# EAGLE design STM32-G0-Dip-Module (EAGLE 9.6.2)

## Sheet 1 of 2
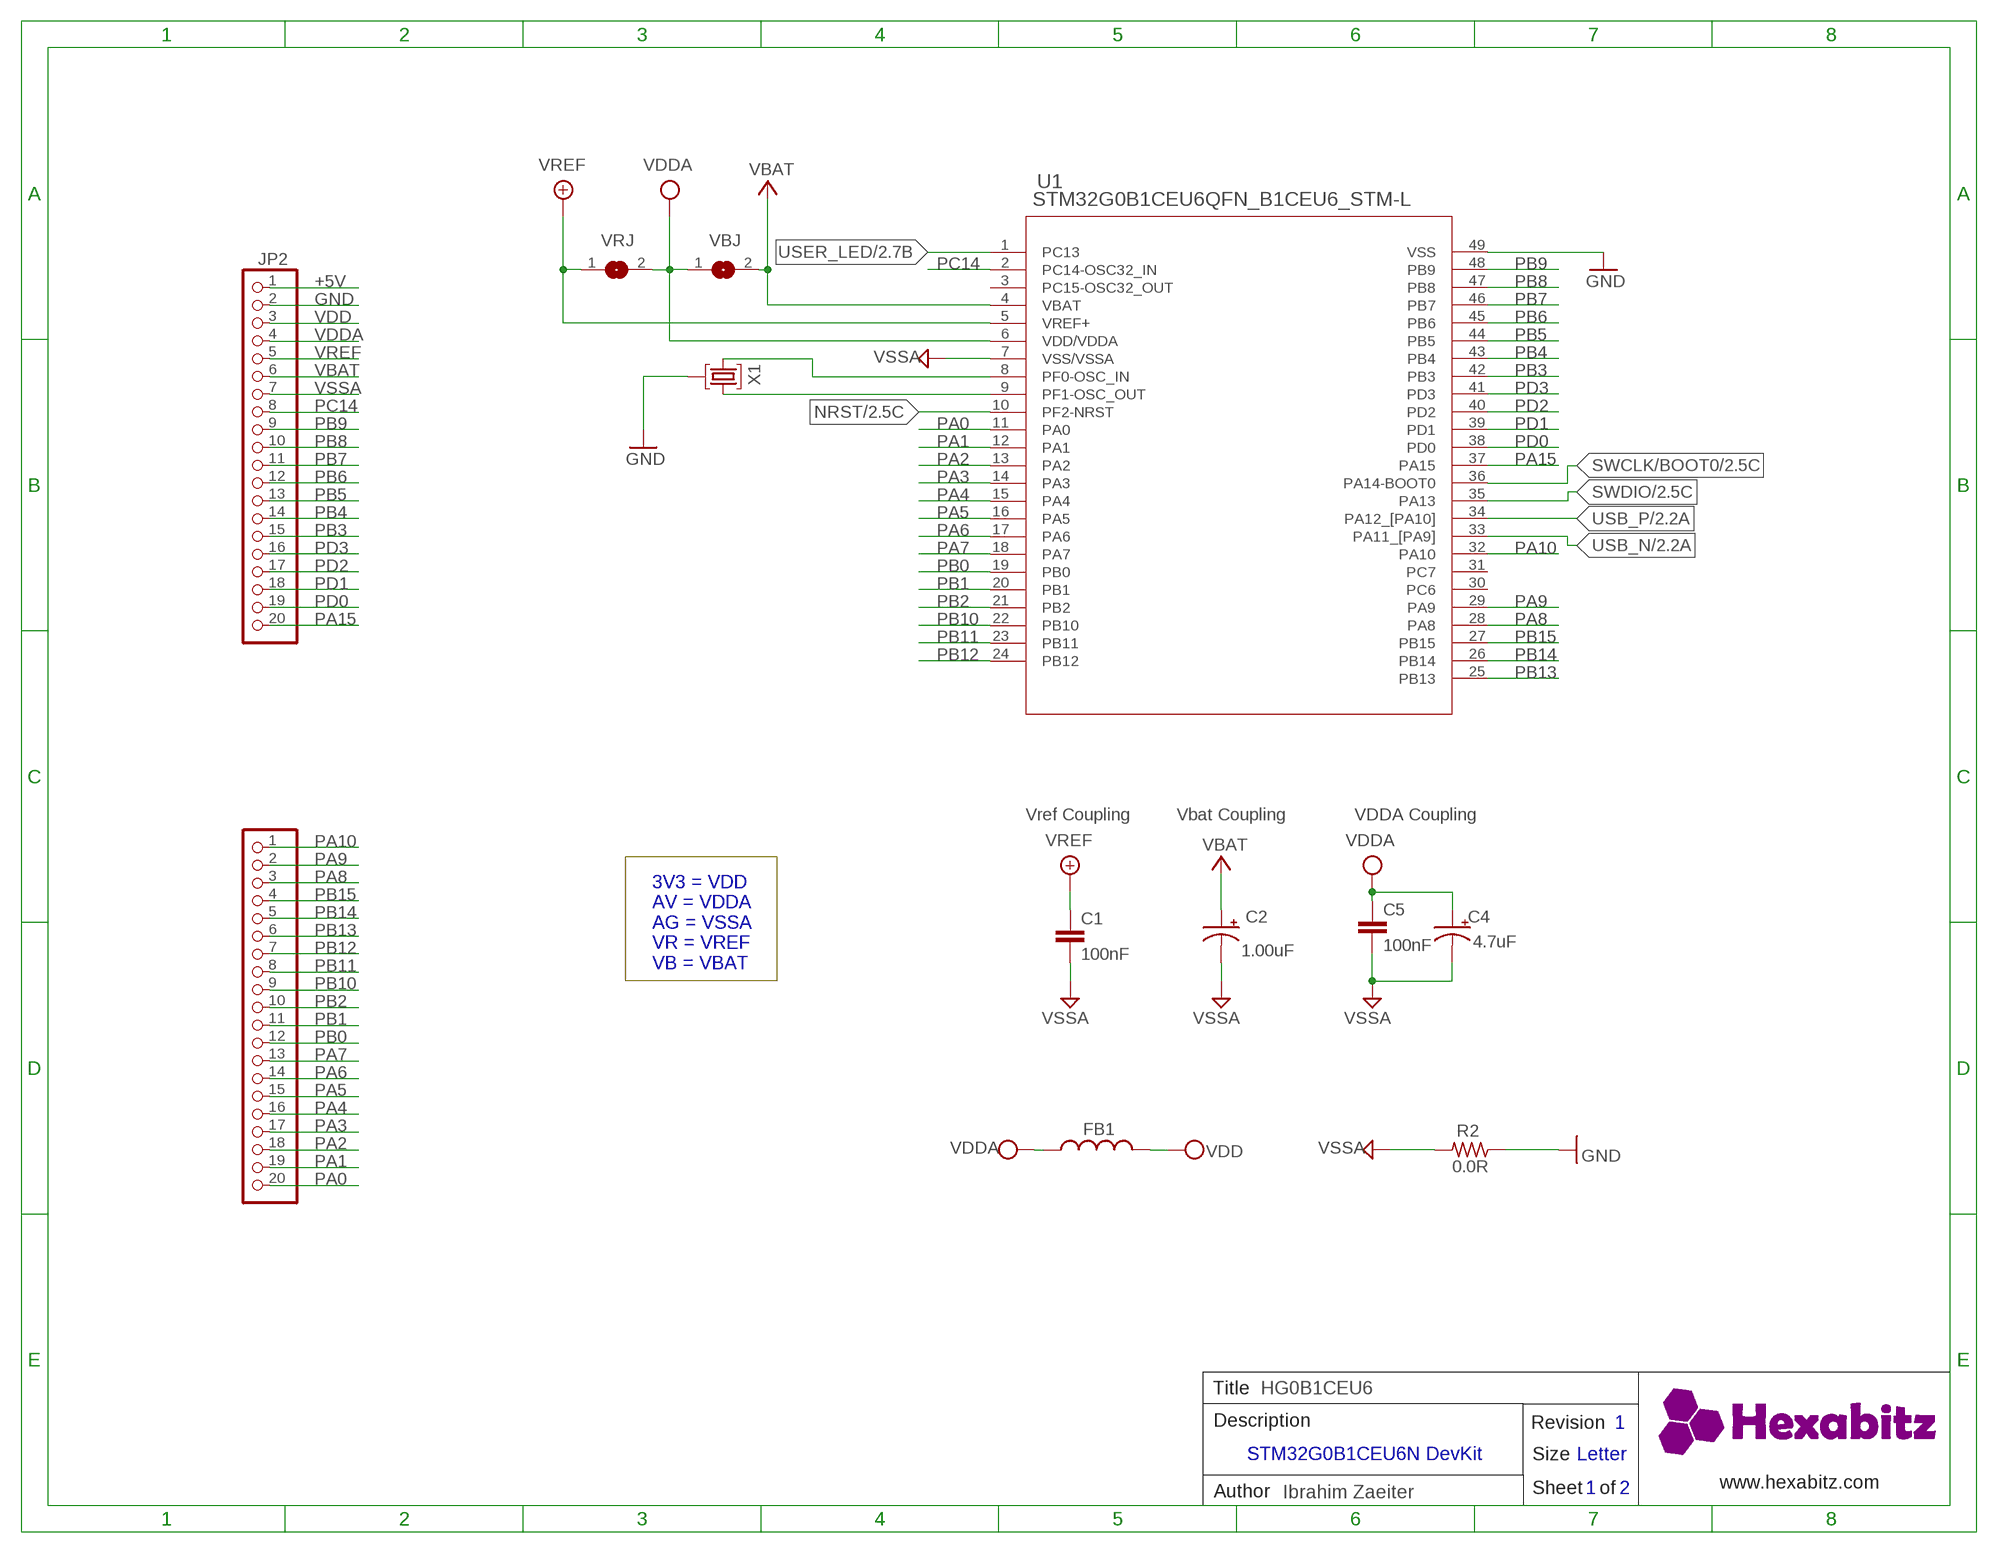
[diagram p0: schematic, sheet 1]

### Parts
C1  100nF  C-0603  [C-0603]
C2  1.00uF  C-0805-POL  [C-0805-POL]
C4  4.7uF  C-0805-POL  [C-0805-POL]
C5  100nF  C-0603  [C-0603]
FB1  FB-TDK_MMZ1608Y300B  [FB-TDK_MMZ1608Y300B]
JP1  PINHD-1X20  [1X20]
JP2  PINHD-1X20  [1X20]
R2  0.0R  R-0603  [R-0603]
U1  STM32G0B1CEU6QFN_B1CEU6_STM-L  [QFN_B1CEU6_STM-L]
VBJ  SJ  [SJ]
VRJ  SJ  [SJ]
X1  XTALL_CSTCE8M00G52  [XTALL_CSTCE8M00G52]

### Nets
+5V: JP2.1 ; also sheet 2
CRYSTAL_N: U1.8(PF0-OSC_IN) X1.P$1
CRYSTAL_P: U1.9(PF1-OSC_OUT) X1.P$3
GND: JP2.2 R2.1 U1.49(VSS) X1.P$2 ; also sheet 2
NRST: U1.10(PF2-NRST) ; also sheet 2
PA0: JP1.20 U1.11(PA0)
PA1: JP1.19 U1.12(PA1)
PA2: JP1.18 U1.13(PA2)
PA3: JP1.17 U1.14(PA3)
PA4: JP1.16 U1.15(PA4)
PA5: JP1.15 U1.16(PA5)
PA6: JP1.14 U1.17(PA6)
PA7: JP1.13 U1.18(PA7)
PA8: JP1.3 U1.28(PA8)
PA9: JP1.2 U1.29(PA9)
PA10: JP1.1 U1.32(PA10)
PA15: JP2.20 U1.37(PA15)
PB0: JP1.12 U1.19(PB0)
PB1: JP1.11 U1.20(PB1)
PB2: JP1.10 U1.21(PB2)
PB3: JP2.15 U1.42(PB3)
PB4: JP2.14 U1.43(PB4)
PB5: JP2.13 U1.44(PB5)
PB6: JP2.12 U1.45(PB6)
PB7: JP2.11 U1.46(PB7)
PB8: JP2.10 U1.47(PB8)
PB9: JP2.9 U1.48(PB9)
PB10: JP1.9 U1.22(PB10)
PB11: JP1.8 U1.23(PB11)
PB12: JP1.7 U1.24(PB12)
PB13: JP1.6 U1.25(PB13)
PB14: JP1.5 U1.26(PB14)
PB15: JP1.4 U1.27(PB15)
PC14: JP2.8 U1.2(PC14-OSC32_IN)
PD0: JP2.19 U1.38(PD0)
PD1: JP2.18 U1.39(PD1)
PD2: JP2.17 U1.40(PD2)
PD3: JP2.16 U1.41(PD3)
SWCLK/BOOT0: U1.36(PA14-BOOT0) ; also sheet 2
SWDIO: U1.35(PA13) ; also sheet 2
USB_N [diff pairs]: U1.33(PA11_[PA9]) ; also sheet 2
USB_P [diff pairs]: U1.34(PA12_[PA10]) ; also sheet 2
USER_LED: U1.1(PC13) ; also sheet 2
VBAT: C2.1(+) JP2.6 U1.4(VBAT) VBJ.2
VDD: FB1.2 JP2.3 ; also sheet 2
VDDA: C4.1(+) C5.1 FB1.1 JP2.4 U1.6(VDD/VDDA) VBJ.1 VRJ.2
VREF: C1.1 JP2.5 U1.5(VREF+) VRJ.1
VSSA: C1.2 C2.2(-) C4.2(-) C5.2 JP2.7 R2.2 U1.7(VSS/VSSA)
Unconnected: U1.3(PC15-OSC32_OUT) U1.30(PC6) U1.31(PC7)

### Notes on the sheet
- C:/Users/Admin/Desktop/logodraft.bmp
- Vref Coupling | Vbat Coupling | VDDA Coupling
- 3V3 = VDD
  AV = VDDA
  AG = VSSA
  VR = VREF
  VB = VBAT
- Title | HG0B1CEU6
- Description | Revision | 1
- STM32G0B1CEU6N DevKit
- Size | Letter
- www.hexabitz.com
- Author | Ibrahim Zaeiter | Sheet   of | 1 | 2

## Sheet 2 of 2
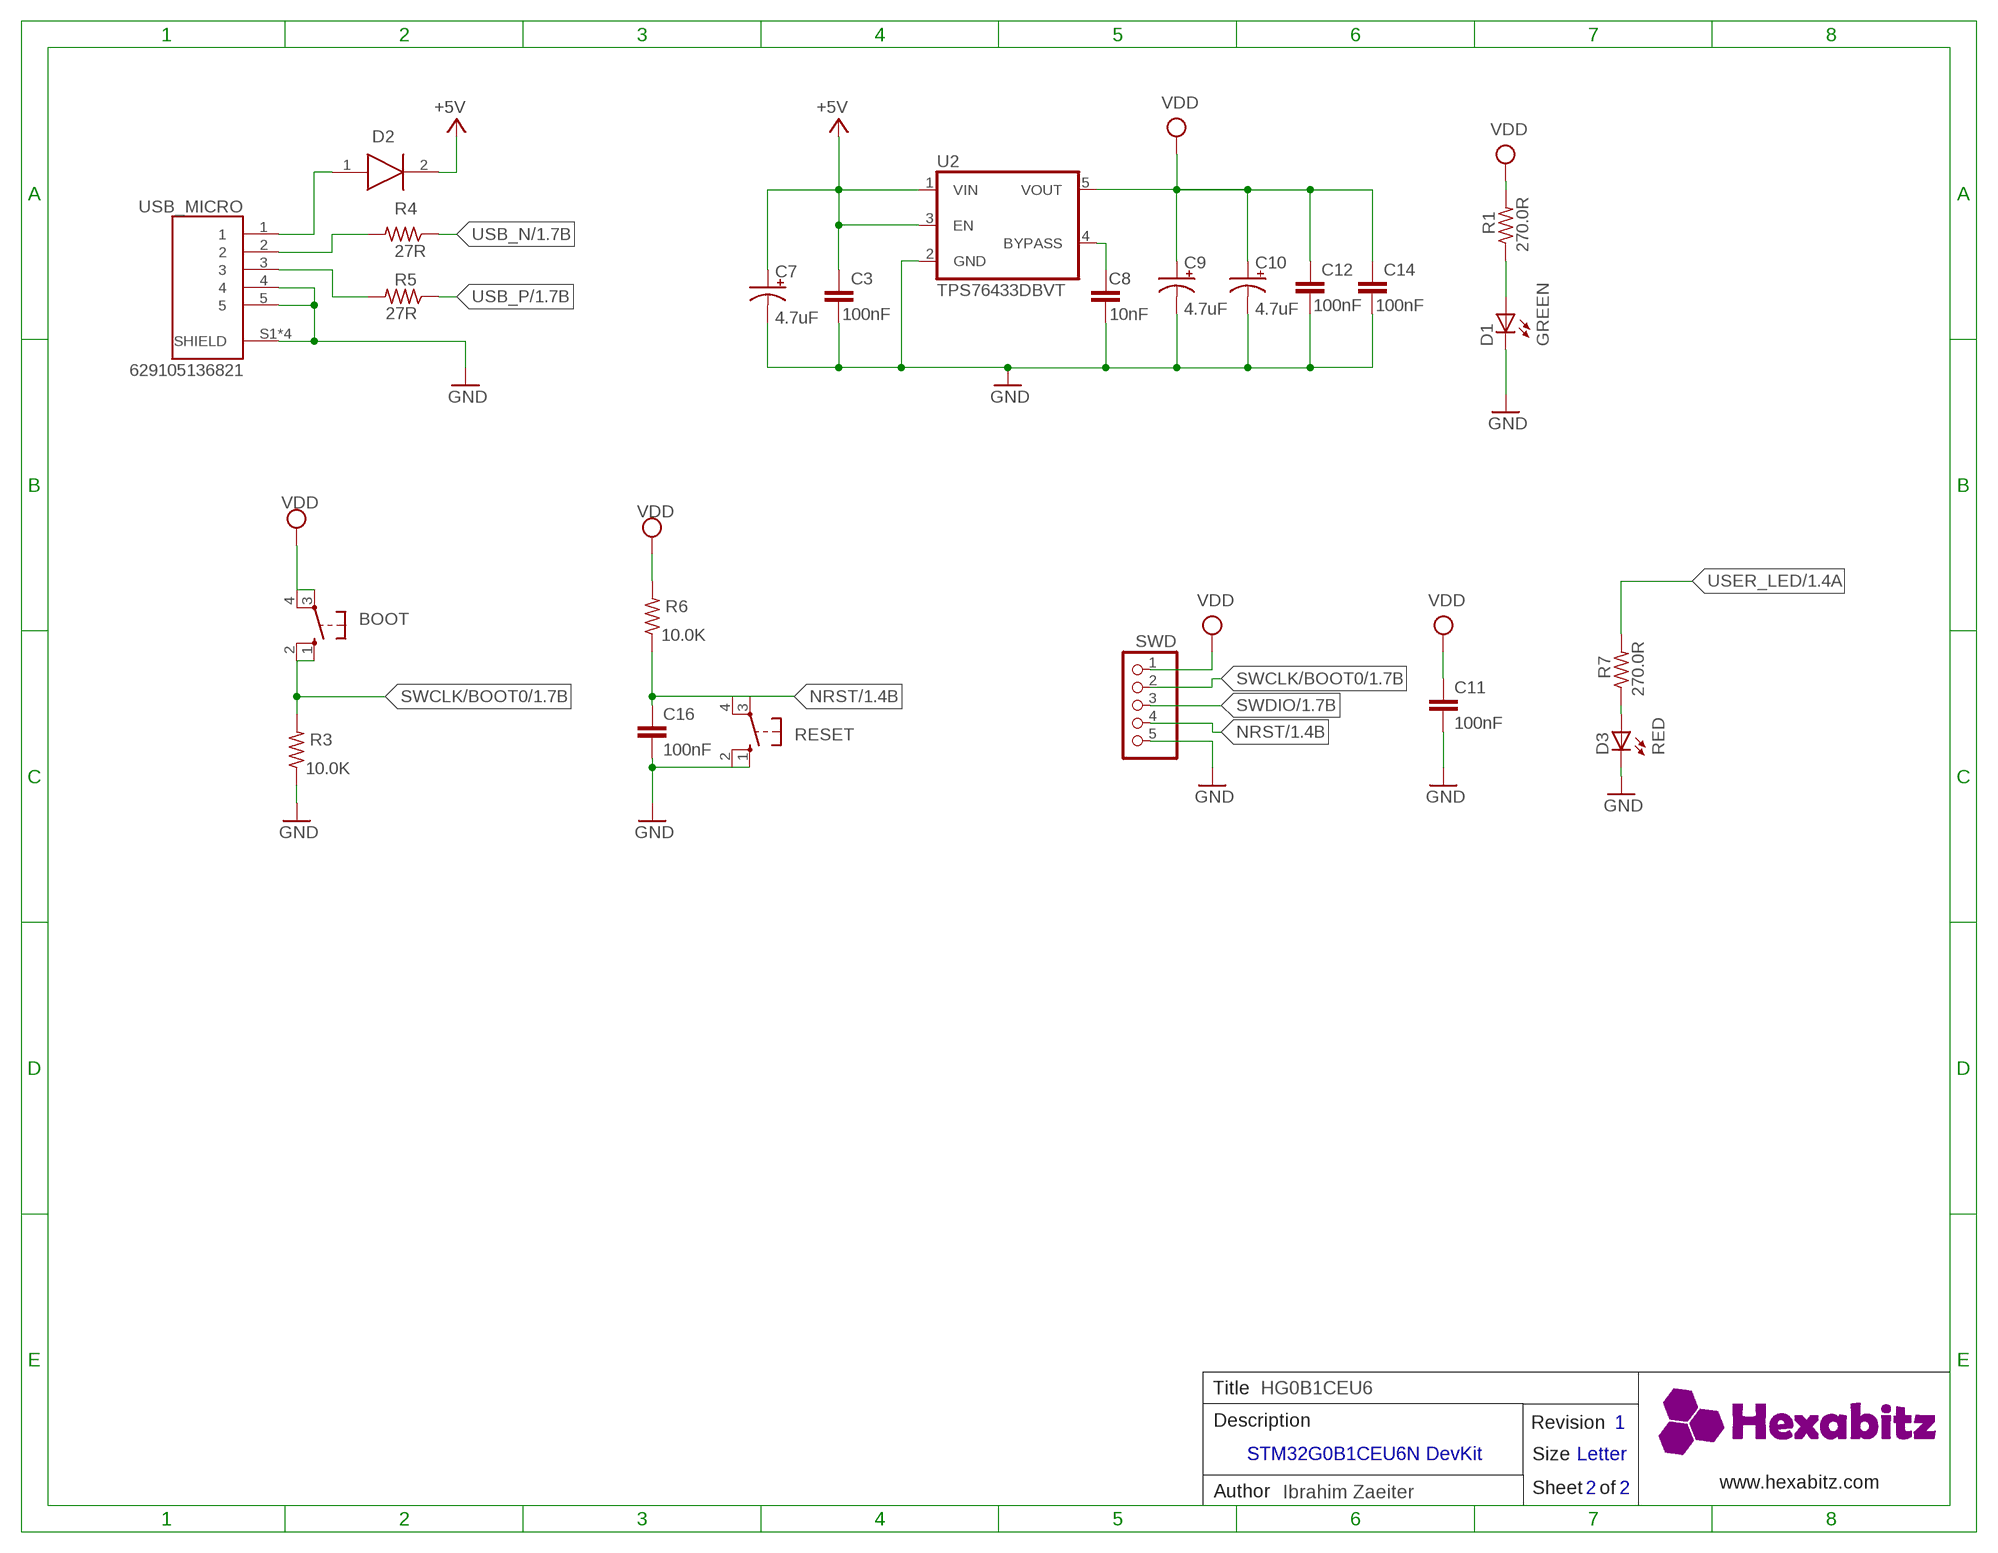
[diagram p1: schematic, sheet 2]

### Parts
BOOT  10-XX  [B3F-10XX]
C3  100nF  C-0603  [C-0603]
C7  4.7uF  C-0805-POL  [C-0805-POL]
C8  10nF  C-0603  [C-0603]
C9  4.7uF  C-0805-POL  [C-0805-POL]
C10  4.7uF  C-0805-POL  [C-0805-POL]
C11  100nF  C-0603  [C-0603]
C12  100nF  C-0603  [C-0603]
C14  100nF  C-0603  [C-0603]
C16  100nF  C-0603  [C-0603]
D1  GREEN  VLMS1300-GS08  [VLMS1300-GS08]
D2  FSM17PL-TP  [FSM17PL-TP]
D3  RED  VLMS1300-GS08  [VLMS1300-GS08]
R1  270.0R  R-0603  [R-0603]
R3  10.0K  R-0603  [R-0603]
R4  27R  R-0603  [R-0603]
R5  27R  R-0603  [R-0603]
R6  10.0K  R-0603  [R-0603]
R7  270.0R  R-0603  [R-0603]
RESET  10-XX  [B3F-10XX]
SWD  PINHD-1X5/90  [1X05/90]
U2  TPS76433DBVT  [SOT25]
USB_MICRO  629105136821  [WE_629105136821]

### Nets
+5V: C3.1 C7.1(+) D2.2(K) U2.1(VIN) U2.3(EN) ; also sheet 1
D_N [diff pairs]: R4.2 USB_MICRO.2
D_P [diff pairs]: R5.2 USB_MICRO.3
GND: C3.2 C7.2(-) C8.2 C9.2(-) C10.2(-) C11.2 C12.2 C14.2 C16.2 D1.C D3.C R3.1 RESET.1(S) RESET.2(S1) SWD.5 U2.2(GND) USB_MICRO.4 USB_MICRO.5 USB_MICRO.S1(SHIELD) USB_MICRO.S2(SHIELD) USB_MICRO.S3(SHIELD) USB_MICRO.S4(SHIELD) ; also sheet 1
N$1: D2.1(A) USB_MICRO.1
N$2: D3.A R7.1
N$4: D1.A R1.1
N$9: C8.1 U2.4(BYPASS)
NRST: C16.1 R6.1 RESET.3(P) RESET.4(P1) SWD.4 ; also sheet 1
SWCLK/BOOT0: BOOT.1(S) BOOT.2(S1) R3.2 SWD.2 ; also sheet 1
SWDIO: SWD.3 ; also sheet 1
USB_N [diff pairs]: R4.1 ; also sheet 1
USB_P [diff pairs]: R5.1 ; also sheet 1
USER_LED: R7.2 ; also sheet 1
VDD: BOOT.3(P) BOOT.4(P1) C9.1(+) C10.1(+) C11.1 C12.1 C14.1 R1.2 R6.2 SWD.1 U2.5(VOUT) ; also sheet 1

### Notes on the sheet
- Title | HG0B1CEU6
- Description | Revision | 1
- STM32G0B1CEU6N DevKit
- Size | Letter
- www.hexabitz.com
- Author | Ibrahim Zaeiter | Sheet   of | 2 | 2

## Library data of the parts
BOOT RESET = switch-omron:10-XX: OMRON SWITCH; MPN: B3F-1000; OC_FARNELL: 176432; OC_NEWARK: 36M3542
C1 C11 C16 = HEXABITZ_RCLS:C-0603: CAP CER 10% X7R 0603; CAPACITANCE: 100nF; MFN: KEMET; MPN: C0603C104K8RACTU; OCTOPART_URL: https://octopart.com/c0603c104k8ractu-kemet-145075?r=sp&s=9bS9ASSwSEqMCE9KBEQZ0g; TOLERANCE: 10%; VOLTAGE_RATING: 10V
C2 = HEXABITZ_RCLS:C-0805-POL: Cap Tant Solid SMD 2012; CAPACITANCE: 1.00uF; MFN: Yageo; MPN: CC0805KKX7R7BB105; OCTOPART_URL: https://octopart.com/cc0805kkx7r7bb105-yageo-8376555?r=sp&s=YKl1wwtkROau_X5nniH2ig; TOLERANCE: 10%; VOLTAGE_RATING: 16V
C3 C5 C8 C12 C14 = HEXABITZ_RCLS:C-0603: CAP CER 10% X7R 0603; CAPACITANCE: 100nF; MFN: KEMET; MPN: C0603C104K8RACTU; OCTOPART_URL: https://octopart.com/c0603c104k8ractu-kemet-145075?r=sp&s=9bS9ASSwSEqMCE9KBEQZ0g; TOLERANCE: 10%; VOLTAGE_RATING: 10
C4 C7 C9 C10 = HEXABITZ_RCLS:C-0805-POL: Cap Tant Solid SMD 2012; CAPACITANCE: 4.7uF; MFN: Murata; MPN: GRM21BC81E475KA12L; OCTOPART_URL: https://octopart.com/grm21bc81e475ka12l-murata-10331911?r=sp&s=RY3qZSD8T6mG6TC9CHI5qQ; TOLERANCE: 10%; VOLTAGE_RATING: 25V
D1 = HEXABITZ_USER_INTERFACE_PARTS:VLMS1300-GS08: Red 0603 130° Clear 54 mcd 2 V Surface Mount ChipLED ; Octopart Url : http://octopart.com/vlms1300-gs08-vishay-21709201; MFN: Vishay; MPN: VLMS1300-GS08; OCTOPART_URL: https://octopart.com/vlms1300-gs08-vishay-21709201?r=sp&s=_gcP4_q8T1SC6PJQPTQ9yA; VALUE: RED
D2 = HEXABITZ_RCLS:FSM17PL-TP: 1.0 A Surface Mount Schottky Barrier Rectifier, 40 V, -65 to 125 degC, 2-Pin SOD-123 Package, RoHS, Tape and Reel
D3 = HEXABITZ_USER_INTERFACE_PARTS:VLMS1300-GS08: Red 0603 130° Clear 54 mcd 2 V Surface Mount ChipLED ; Octopart Url : http://octopart.com/vlms1300-gs08-vishay-21709201; MFN: Vishay; MPN: VLMS1300-GS08; OCTOPART_URL: https://octopart.com/vlms1300-gs08-vishay-21709201?r=sp&s=_gcP4_q8T1SC6PJQPTQ9yA
FB1 = HEXABITZ_RCLS:FB-TDK_MMZ1608Y300B: Ferrite Beads Multi-Layer 30Ohm 25% 100MHz 1.5A 50mOhm DCR 0603; MFN: TDK; MPN: MMZ1608Y300B; OCTOPART_URL: https://octopart.com/mmz1608y300b-tdk-368280?r=sp&s=cd9_2ZEqQ9q9UNBuQgHAiA
JP1 JP2 = pinhead:PINHD-1X20: PIN HEADER
R1 R7 = HEXABITZ_RCLS:R-0603: Thick Film Resistors - SMD 0603; MFN: Yageo; MPN: RC0603FR-07270RL; OCTOPART_URL: https://octopart.com/search?q=RC0603FR-07270RL&start=0; RESISTANCE: 270.0 Ohm; TOLERANCE: 1%
R2 = HEXABITZ_RCLS:R-0603: Thick Film Resistors - SMD 0603; MFN: Yageo; MPN: RC0603JR-070RL; OCTOPART_URL: https://octopart.com/rc0603jr-070rl-yageo-1241539?r=sp&s=X2NteqRjRNWrnx42Y0aliA; RESISTANCE: 0.0 Ohm
R3-R6 = HEXABITZ_RCLS:R-0603: Thick Film Resistors - SMD 0603; MFN: Yageo; MPN: RC0603JR-0710KL; OCTOPART_URL: https://octopart.com/search?q=RC0603JR-0710KL&start=0; RESISTANCE: 10.0K Ohm; TOLERANCE: 5%
SWD = pinhead:PINHD-1X5: PIN HEADER
U1 = HEXABITZ_ICs:STM32G0B1CEU6; COPYRIGHT: Copyright (C) 2021 Ultra Librarian. All rights reserved.; MANUFACTURER_PART_NUMBER: STM32G0B1CEU6; MFR_NAME: STMicroelectronics
U2 = HEXABITZ_ICs:TPS764: 150mA Low Noise LDO Voltage Regulator with Enable; MFN: Texas Instruments; MPN: TPS76433DBVT; OCTOPART_URL: https://octopart.com/tps76433dbvt-texas+instruments-69873?r=sp&s=0aHKKhMLSUCTmmqJkhwwIQ
USB_MICRO = 629105136821:629105136821: WR-COM SMT Horizontal 5 Contacts Micro USB Type B,5 pins Check availability <https://pricing.snapeda.com/parts/629105136821/W%C3%BCrth%20Elektronik/view-part?ref=eda>; AVAILABILITY: In Stock; DESCRIPTION: USB - micro B USB 2.0 Receptacle Connector 5 Position Surface Mount, Right Angle; MF: Würth Elektronik; MP: 629105136821; PACKAGE: None; PRICE: None; PURCHASE-URL: https://pricing.snapeda.com/search/part/629105136821/?ref=eda
VBJ VRJ = jumper:SJ: SMD solder JUMPER
X1 = HEXABITZ_OTHER_PARTS:XTALL_CSTCE8M00G52: MURATA CSTCE8M00G52-R0 RESONATOR, SMD, 8MHZ ; Octopart Url : https://octopart.com/cstce8m00g52-r0-murata-7145559; MFN: Murata; MPN: CSTCE8M00G52Z-R0; OCTOPART_URL: https://octopart.com/cstce8m00g52z-r0-murata-17755941?r=sp&s=JDnNJnrHQhyS8Zk4ofFWXw

## Net classes
1 diff pairs: width 0.203 mm, clearance 0.178 mm

## Board
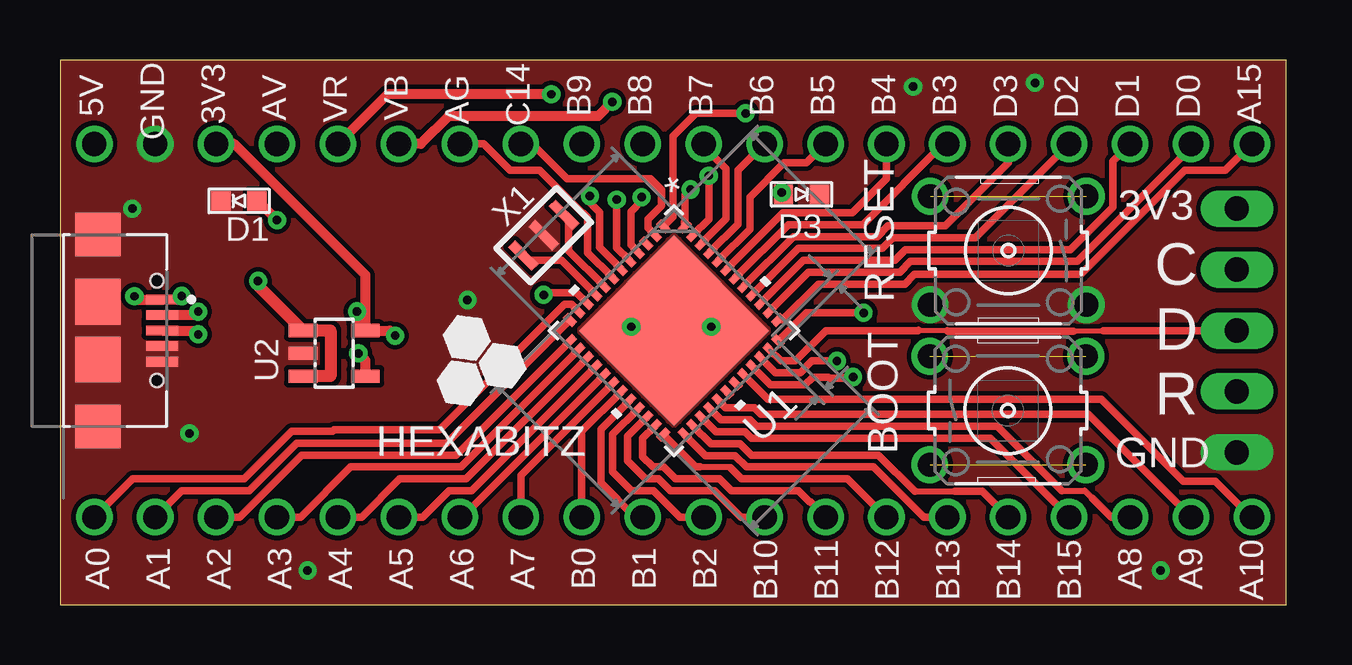
[diagram p2: board, top side]
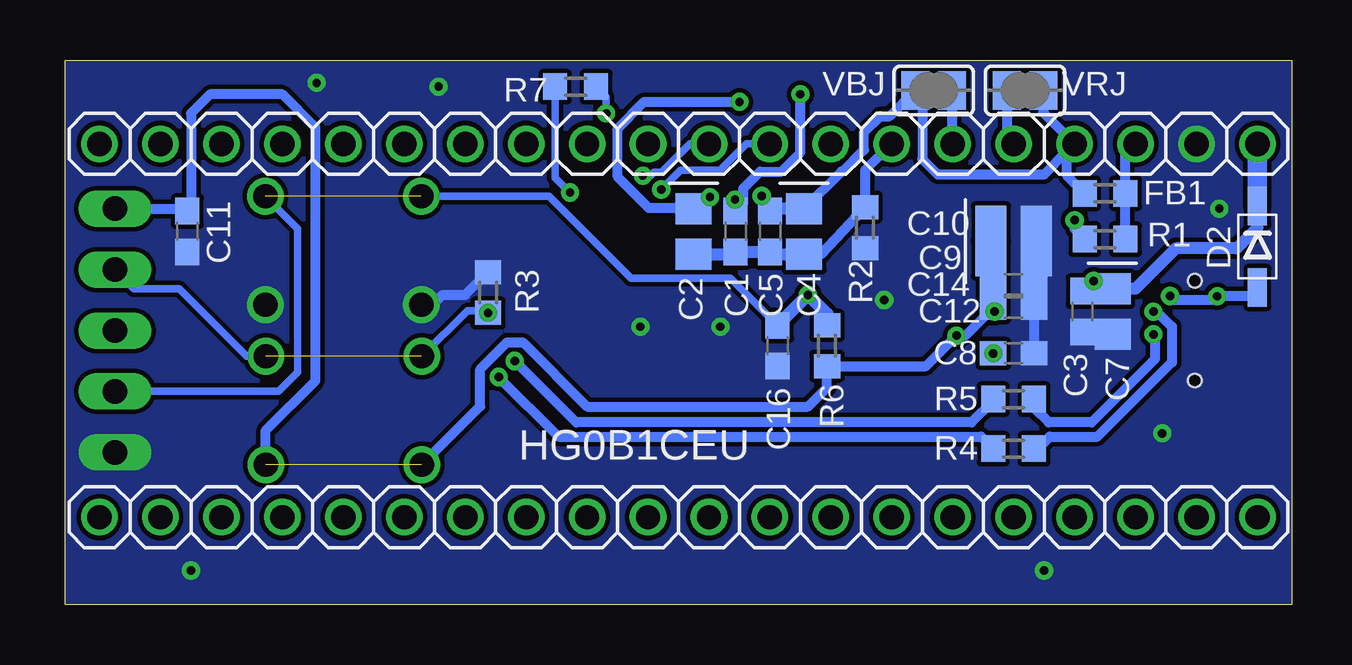
[diagram p3: board, bottom side, seen from below]

Size 51.12 x 22.7 mm. Coordinates in mm from the lower left corner, seen from the top.
Outline: 0,22.7 0,0 51.12,0 51.12,22.7 0,22.7
Copper layers (1*16): Top 0.035mm / dielectric 1.5mm / Bottom 0.035mm
Design rules "default *": minimum track width 6mil, minimum drill 0.35mm, track to track 7.5mil, track to pad 7.5mil, pad to pad 7.5mil, via to via 7.5mil, smd to smd 0mil, copper to edge 1mil, drill to drill 6mil, minimum pad ring 10mil, minimum via ring 8mil, stop-mask expansion 4mil, vias tented up to drill 25mil, thermal gap 10mil

### Footprints (pad centres in the part's own frame; a part is rotated, then mirrored left to right if it is on the bottom)
B3F-10XX = drill 1.016: 1 -3.251,2.261; 2 3.251,2.261; 3 -3.251,-2.261; 4 3.251,-2.261
C-0603 = smd 1.1 x 1: 1 -0.85,0; 2 0.85,0
C-0805-POL = smd 1.3 x 1.5: 1 -0.95,0; 2 0.95,0
VLMS1300-GS08 = smd 0.8 x 0.8: A 0,0.75; C 0,-0.75
FSM17PL-TP = smd 1.6 x 0.8: 1 -1.7,0; 2 1.7,0
FB-TDK_MMZ1608Y300B = smd 1 x 1.1: 1 -0.85,0; 2 0.85,0
1X20 = drill 1.016: 1 -24.13,0; 2 -21.59,0; 3 -19.05,0; 4 -16.51,0; 5 -13.97,0; 6 -11.43,0; 7 -8.89,0; 8 -6.35,0; 9 -3.81,0; 10 -1.27,0; 11 1.27,0; 12 3.81,0; 13 6.35,0; 14 8.89,0; 15 11.43,0; 16 13.97,0; 17 16.51,0; 18 19.05,0; 19 21.59,0; 20 24.13,0
R-0603 = smd 1 x 1.1: 1 -0.85,0; 2 0.85,0
1X05/90 = drill 1.016 long: 1 -5.08,-3.81; 2 -2.54,-3.81; 3 0,-3.81; 4 2.54,-3.81; 5 5.08,-3.81
QFN_B1CEU6_STM-L = smd 0.55 x 0.3: 1 -3.38,2.751; 2 -3.38,2.251; 3 -3.38,1.75; 4 -3.38,1.25; 5 -3.38,0.75; 6 -3.38,0.25; 7 -3.38,-0.25; 8 -3.38,-0.75; 9 -3.38,-1.25; 10 -3.38,-1.75; 11 -3.38,-2.251; 12 -3.38,-2.751; 25 3.38,-2.751; 26 3.38,-2.251; 27 3.38,-1.75; 28 3.38,-1.25; 29 3.38,-0.75; 30 3.38,-0.25; 31 3.38,0.25; 32 3.38,0.75; 33 3.38,1.25; 34 3.38,1.75; 35 3.38,2.251; 36 3.38,2.751 | smd 0.3 x 0.55: 13 -2.751,-3.38; 14 -2.251,-3.38; 15 -1.75,-3.38; 16 -1.25,-3.38; 17 -0.75,-3.38; 18 -0.25,-3.38; 19 0.25,-3.38; 20 0.75,-3.38; 21 1.25,-3.38; 22 1.75,-3.38; 23 2.251,-3.38; 24 2.751,-3.38; 37 2.751,3.38; 38 2.251,3.38; 39 1.75,3.38; 40 1.25,3.38; 41 0.75,3.38; 42 0.25,3.38; 43 -0.25,3.38; 44 -0.75,3.38; 45 -1.25,3.38; 46 -1.75,3.38; 47 -2.251,3.38; 48 -2.751,3.38 | smd 5.6 x 5.6: 49 0,0
SOT25 = smd 0.55 x 1.2: 1 -0.95,-1.3; 2 0,-1.3; 3 0.95,-1.3; 4 0.95,1.3; 5 -0.95,1.3
WE_629105136821 = smd 0.4 x 1.35: 1 -1.3,2.675; 2 -0.65,2.675; 3 0,2.675; 4 0.65,2.675; 5 1.3,2.675 | smd 1.8 x 1.9: S1 -4,0; S4 4,0 | smd 1.9 x 1.9: S2 -1.2,0; S3 1.2,0 | hole 0.55: -2.075,2.45; 2.075,2.45
SJ = smd 1.168 x 1.6: 1 -0.762,0; 2 0.762,0
XTALL_CSTCE8M00G52 = smd 1.4 x 0.4: P$1 0,1.2; P$2 0,0; P$3 0,-1.2

### Placement (x,y rotation side)
BOOT  39.51,8.1 0 top
C1  23.18,15.56 270 bottom
C2  24.92,15.56 270 bottom
C3  8.73,12.22 270 bottom
C4  20.32,15.56 270 bottom
C5  21.75,15.56 270 bottom
C7  7.46,12.22 270 bottom
C8  11.59,10.48 0 bottom
C9  11.59,14.45 0 bottom
C10  11.59,15.88 0 bottom
C11  46.04,15.56 270 bottom
C12  11.59,12.38 0 bottom
C14  11.59,13.34 0 bottom
C16  21.43,10.79 270 bottom
D1  7.46,16.83 270 top
D2  1.43,14.92 90 bottom
D3  30.91,17.1 90 top
FB1  7.78,17.14 0 bottom
JP1  25.56,3.65 180 top
JP2  25.56,19.21 0 top
R1  7.78,15.24 0 bottom
R2  17.78,15.72 90 bottom
R3  33.5,13.02 270 bottom
R4  11.59,6.51 0 bottom
R5  11.59,8.57 0 bottom
R6  19.37,10.79 270 bottom
R7  29.84,21.59 0 bottom
RESET  39.53,14.76 180 top
SWD  52.86,11.43 270 top
U1  25.59,11.43 315 top
U2  11.43,10.48 270 top
USB_MICRO  1.59,11.43 270 top
VBJ  14.92,21.43 0 bottom
VRJ  11.11,21.43 0 bottom
X1  20.16,15.4 315 top

### Tracks (layer width: path | path; a pad name or v marks a point on that pad's centre or on a via)
+5V  (via drill 0.35)
  Top 0.508: U2.3 11.27,9.53 11.27,11.43 U2.1 8.25,13.3 v8.25,13.49
  Bottom 0.508: 1.43,17.14 1.43,15.72 2.29,14.85 4.83,14.85 6.51,13.17 C7.1 7.94,13.17 v8.25,13.49 8.31,13.49 C3.1
  Bottom 0.813: JP2.1 1.43,17.14 D2.2
CRYSTAL_N
  Top 0.305: X1.P$1 21.2,16.05 21.2,14.76 U1.8
CRYSTAL_P
  Top 0.305: X1.P$3 19.51,14.36 20.9,14.36 U1.9
D_N  (via drill 0.35)
  Top 0.406: USB_MICRO.2 5.75,12.08 5.76,12.09 v5.76,12.22
  Bottom 0.406: R4.2 10.58,6.51 10.08,7 8.09,7 4.99,10.11 4.99,11.59 5.62,12.22 v5.76,12.22
D_P  (via drill 0.35)
  Top 0.406: USB_MICRO.3 5.75,11.43 5.76,11.42 v5.76,11.27
  Bottom 0.406: R5.2 10.74,8.21 10.13,7.6 8.34,7.6 5.71,10.23 5.71,11.22 v5.76,11.27
GND  (via drill 0.35)
  Bottom 0.406: C10.2 C9.2 10.74,14.35 C14.2 C12.2 C8.2 | R3.1 34.45,12.91 35.39,12.91 35.8,12.5 RESET.2
  other vias: 23.81,11.59 27.15,11.59 16.99,12.7 5.4,7.14 3.02,16.51 10.32,1.43 45.88,1.43 40.64,21.75 35.56,21.59
  pour Bottom (no thermals): 0,22.7 51.12,22.7 51.12,0 0,0
  pour Top (no thermals): 0,22.7 51.12,22.7 51.12,0 0,0
N$1  (via drill 0.35)
  Top 0.406: v3.11,12.86 3.26,12.7 4.23,12.7 USB_MICRO.1 4.28,12.71 4.91,12.71 v5.07,12.87
  Bottom 0.406: D2.1 1.79,12.86 v3.11,12.86 3.26,12.71 4.91,12.71 v5.07,12.87
N$2  (via drill 0.35)
  Top 0.305: v30.08,17.18 D3.A
  Bottom 0.305: R7.1 30.69,17.79 v30.08,17.18
N$4  (via drill 0.35)
  Top 0.406: v9.05,16.03 8.25,16.83 D1.A
  Bottom 0.406: v9.05,16.03 9.05,15.66 R1.1
N$9  (via drill 0.35)
  Top 0.406: U2.4 12.73,10.19 C8.1
  other vias: 12.44,10.48
NRST  (via drill 0.35)  (1 unrouted)
  Top 0.305: v20.16,12.91 20.26,13.01 21.53,13.01 U1.10
  Bottom 0.305: SWD.4 42.23,8.89 41.43,9.68 41.43,15.68 RESET.3 | RESET.4 30.95,17.02 27.54,13.62 23.4,13.62 C16.1
  Bottom 0.533: C16.1 v20.16,12.91 19.37,12.12 R6.1
PA0
  Top 0.305: JP1.20 3.03,5.25 7.69,5.25 9.67,7.23 11.36,7.23 11.43,7.3 15.82,7.3 20.62,12.1 20.61,12.1 21.03,12.52 21.31,12.52 U1.11
PA1
  Top 0.305: U1.12 20.33,10.95 16.12,6.74 9.87,6.74 7.89,4.76 5.07,4.76 JP1.19
PA2
  Top 0.305: JP1.18 7.49,3.65 10.08,6.24 16.51,6.24 U1.13
PA3
  Top 0.305: U1.14 16.73,5.75 12.12,5.75 10.03,3.65 JP1.17
PA4
  Top 0.305: U1.15 16.94,5.25 14.17,5.25 12.57,3.65 JP1.16
PA5
  Top 0.305: U1.16 17.15,4.76 16.21,4.76 15.11,3.65 JP1.15
PA6
  Top 0.305: U1.17 16.75,3.65 JP1.14
PA7
  Top 0.305: U1.18 19.21,5.4 JP1.13
PA8
  Top 0.254: 41.75,4.76 42.71,4.76 43.02,4.45
  Top 0.305: U1.28 27.56,7.7 28.75,7.7 29.02,7.44 39.07,7.44 41.75,4.76 | 43.02,4.45 43.81,3.65 JP1.3
PA9
  Top 0.305: U1.29 27.74,8.22 28.94,8.22 29.23,7.93 42.87,7.93 JP1.2
PA10
  Top 0.305: JP1.1 49.66,3.65 48.16,5.15 46.82,5.15 43.4,8.57 29.51,8.57 U1.32
PA15
  Top 0.305: U1.37 30.12,11.88 31.61,13.37 35.21,13.37 35.61,13.77 42.56,13.77 46.89,18.1 48.58,18.1 JP2.20
PB0
  Top 0.305: JP1.12 21.75,7.23 U1.19
PB1
  Top 0.305: JP1.11 23.97,3.65 22.54,5.08 22.54,7.32 U1.20
PB2
  Top 0.305: JP1.10 25.85,3.65 24.75,4.76 23.82,4.76 23.04,5.54 23.04,7.11 U1.21
PB3
  Top 0.305: U1.42 30.36,15.84 33.46,15.84 36.83,19.21 JP2.15
PB4
  Top 0.305: JP2.14 34.45,17.76 33.03,16.34 30.14,16.34 U1.43
PB5
  Top 0.305: U1.44 28.76,15.66 28.76,16.99 30.18,18.41 31.11,18.41 JP2.13
PB6
  Top 0.305: U1.45 28.26,15.87 28.26,18.1 JP2.12
PB7
  Top 0.305: JP2.11 26.83,19.11 27.77,18.18 27.77,16.08 U1.46
PB8  (via drill 0.35)
  Top 0.305: v27.04,17.88 27.04,16.07 U1.47
  Bottom 0.305: JP2.10 25.08,19.21 26.26,18.02 26.58,18.02 26.73,17.88 v27.04,17.88
PB9  (via drill 0.35)
  Top 0.305: v26.28,17.3 26.05,17.08 26.05,15.97 26.04,15.96 U1.48
  Bottom 0.305: JP2.9 22.73,19.21 23.83,18.1 25.48,18.1 v26.28,17.3
PB10
  Top 0.305: JP1.9 28.39,3.65 27.29,4.76 25.45,4.76 24.95,5.25 24.41,5.25 23.65,6 23.65,7.02 U1.22
PB11
  Top 0.305: JP1.8 31.27,4.29 31.25,4.29 30.78,4.76 27.99,4.76 27.49,5.25 25.65,5.25 25.16,5.75 24.72,5.75 24.29,6.18 24.29,6.94 U1.23
PB12
  Top 0.254: 26.67,5.75 27.91,5.75 27.94,5.71
  Top 0.305: U1.24 26.49,5.75 26.67,5.75 | 27.94,5.71 28.4,5.25 32.82,5.25 34.42,3.65 JP1.7
PB13
  Top 0.305: JP1.6 36.01,3.65 33.92,5.75 28.61,5.75 28.14,6.22 26.91,6.22 U1.25
PB14
  Top 0.254: 35.63,4.73 37.31,4.73
  Top 0.305: 35.63,4.73 34.12,6.24 28.81,6.24 28.34,6.71 27.13,6.71 U1.26 | 37.31,4.73 38.45,4.73 JP1.5
PB15
  Top 0.305: U1.27 27.35,7.21 28.55,7.21 28.82,6.94 38.78,6.94 JP1.4
PC14
  Top 0.305: U1.2 24.5,15.71 24.5,16.07 25.06,16.62 25.06,17.3 24.61,17.75 21.14,17.75 19.68,19.21 JP2.8
PD0
  Top 0.305: JP2.19 47.15,19.06 42.4,14.31 35.45,14.31 35.01,13.86 31.2,13.86 U1.38
PD1
  Top 0.305: U1.39 30.99,14.36 34.8,14.36 35.25,14.8 42.12,14.8 43.88,16.57 43.88,18.48 JP2.18
PD2
  Top 0.305: U1.40 30.79,14.85 34.28,14.85 34.73,15.3 38.16,15.3 JP2.17
PD3
  Top 0.305: JP2.16 39.53,18.41 36.91,15.79 34.52,15.79 34.07,15.35 30.57,15.35 U1.41
SWCLK/BOOT0  (via drill 0.35)  (1 unrouted)
  Top 0.305: U1.36 31.11,12.17 R3.2
  Bottom 0.305: R3.2 33.59,12.26 34.35,12.26 BOOT.1 | BOOT.2 43.55,10.36 46.37,13.18 48.26,13.18 SWD.2
  other vias: 33.5,12.17
SWDIO
  Top 0.203: 35.78,11.44 36.98,11.44 36.99,11.43 | 42.25,11.41 42.32,11.41 43.48,11.41 43.5,11.43
  Top 0.305: 35.78,11.44 35.77,11.43 31.92,11.43 30.65,10.16 30.04,10.16 U1.35 | 36.99,11.43 37.01,11.41 42.25,11.41 | 43.5,11.43 SWD.3
USB_N  (via drill 0.35)
  Top 0.305: v33.05,9.49 32.73,9.49 32.68,9.44 32.09,9.44 32.03,9.49 31.38,9.49 31.06,9.17 29.62,9.17 U1.33
  Bottom 0.406: R4.1 12.93,7 30.57,7 v33.05,9.49
USB_P  (via drill 0.35)
  Top 0.305: v32.38,10.16 31.35,10.16 30.85,9.66 29.83,9.66 U1.34
  Bottom 0.406: R5.1 12.44,8.51 13.34,7.6 29.83,7.6 v32.38,10.16
USER_LED  (via drill 0.35)
  Top 0.305: U1.1 25.56,16.18 25.56,19.53 26.51,20.48 v28.57,20.48
  Bottom 0.305: R7.2 28.57,21.17 v28.57,20.48
VBAT  (via drill 0.35)
  Top 0.305: v24.25,16.99 24.25,16.83 23.8,16.38 23.8,15 24.09,14.71 U1.4
  Top 0.406: v23.02,20.95 22.43,20.36 16.19,20.36 15.03,19.21 JP2.6
  Bottom 0.305: v24.25,16.99 24.44,16.99 C2.1
  Bottom 0.406: VBJ.2 14.16,19.24 JP2.6 | C2.1 24.95,16.53 26.79,16.53 28.1,17.84 28.1,19.84 26.99,20.95 v23.02,20.95
VDD  (via drill 0.35)  (1 unrouted)
  Top 0.406: U2.5 12.73,13.73 7.26,19.21 JP2.3 | U2.5 12.38,11.78 v12.38,12.22 | U2.5 13.76,11.43 v13.97,11.21
  Bottom 0.406: C10.1 C9.1 12.54,13.44 C14.1 | C14.1 C12.1 13.61,11.21 v13.97,11.21 15.24,9.95 R6.2 19.37,9.05 20.16,8.26 29.37,8.26 32.05,10.93 32.7,10.93 33.83,9.81 33.83,8.27 BOOT.3 | R1.2 FB1.2 6.93,18.79 JP2.3 | C14.1 12.44,12.28 v12.38,12.22 | SWD.1 46.14,16.51 | 46.14,16.51 C11.1 | BOOT.4 42.76,7.26 40.68,9.34 40.68,19.89 42.07,21.27 45.08,21.27 45.88,20.48 45.88,16.77 46.14,16.51
VDDA  (via drill 0.35)
  Top 0.305: U1.6 22.48,14.89 22.48,16.35 22.09,16.75 v22.09,17.03
  Bottom 0.305: v22.09,17.03 21.65,16.59 21.65,16.51
  Bottom 0.406: VRJ.2 10.35,20.51 JP2.4 9.37,18.89 | 9.37,18.89 10.32,17.94 14.76,17.94 15.4,18.57 15.4,21.14 VBJ.1 16.75,20.36 17.15,20.36 17.82,19.69 17.82,18.96 18.73,18.05 18.77,18.05 C4.1 | FB1.1 9.37,17.88 9.37,18.89
  Bottom 0.508: C4.1 21.65,16.51 C5.1
VREF  (via drill 0.35)
  Top 0.305: U1.5 23.21,14.88 v23.21,16.88
  Top 0.406: v20.48,21.27 13.65,21.27 JP2.5
  Bottom 0.305: C1.1 23.21,16.43 v23.21,16.88
  Bottom 0.406: VRJ.1 11.87,19.49 JP2.5 | C1.1 22.86,16.73 22.86,17.35 22.16,18.05 21.27,18.05 20.48,18.84 v20.48,21.27
VSSA
  Top 0.305: U1.7 21.99,14.68 21.99,16.15 21.83,16.31 21.79,16.31 20,18.1 18.75,18.1 17.65,19.21 JP2.7
  Bottom 0.406: C4.2 19.63,14.61 R2.2 17.78,18.1 JP2.7
  Bottom 0.508: C2.2 23.28,14.61 C1.2 C5.2 21.65,14.61 C4.2

### Text on the board
tPlace: GND | 3V3 | C14 | A15 | 5V | AV | VR | VB | AG | B9 | B8 | B7 | B6 | B5 | B4 | B3 | D3 | D2 | D1 | D0 | 3V3 | C | D | R | HEXABITZ | GND | A0 | A1 | A2 | A3 | A4 | A5 | A6 | A7 | B0 | B1 | B2 | A8 | A9 | B10 | B11 | B12 | B13 | B14 | B15 | A10
bNames: HG0B1CEU